# Altium schematic sheet Sheet1.SchDoc
size A4
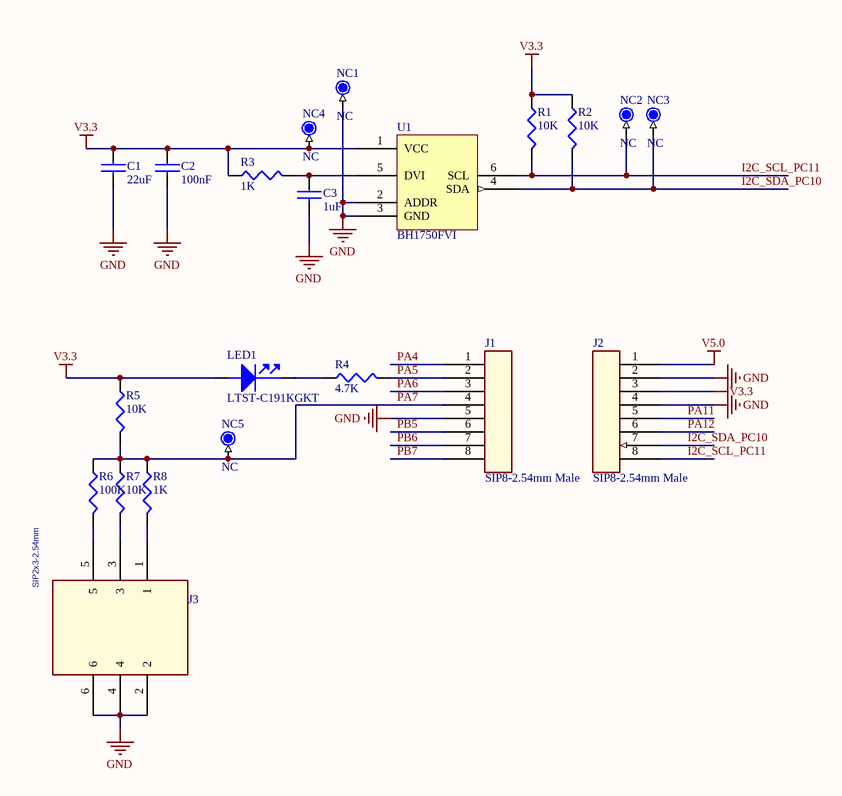
[diagram p0: Sheet1.SchDoc]

## Parts
C1  22uF  [SC0805]
C2  100nF  [SC0603]
C3  1uF  [SC0603]
J1  SIP8-2.54mm Male  [SIP-8P-100]
J2  SIP8-2.54mm Male  [SIP-8P-100]
J3  SIP2x3-2.54mm  [SIP-2X3P-100]
LED1  LTST-C191KGKT  [HSD0603-LED]
NC1  NC  [TP32-SMD]
NC2  NC  [TP32-SMD]
NC3  NC  [TP32-SMD]
NC4  NC  [TP32-SMD]
NC5  NC  [TP32-SMD]
R1  10K  [SR0603]
R2  10K  [SR0603]
R3  1K  [SR0603]
R4  4.7K  [SR0603]
R5  10K  [SR0603]
R6  100K  [SR0603]
R7  10K  [SR0603]
R8  1K  [SR0603]
U1  BH1750FVI  [sop6-20-105]

## Nets
GND: C1.2 C2.2 C3.2 J1.5 J2.2 J2.4 J3.2 J3.4 J3.6 NC1.1 U1.2(ADDR) U1.3(GND)
V3.3: C1.1 C2.1 J2.3 LED1.1 NC4.1 R1.1 R2.1 R3.1 R5.1 U1.1(VCC)
V5.0: J2.1
I2C_SCL_PC11: J2.8 NC2.1 R1.2 U1.6(SCL)
I2C_SDA_PC10: J2.7 NC3.1 R2.2 U1.4(SDA)
PA4: J1.1
PA5: J1.2 R4.2
PA6: J1.3
PA7: J1.4 NC5.1 R5.2 R6.1 R7.1 R8.1
PA11: J2.5
PA12: J2.6
PB5: J1.6
PB6: J1.7
PB7: J1.8
NetC3_1: C3.1 R3.2 U1.5(DVI)
NetJ3_1: J3.1 R8.2
NetJ3_3: J3.3 R7.2
NetJ3_5: J3.5 R6.2
NetLED1_2: LED1.2 R4.1

## Library data of the parts
C1-C3 = CAP NP
J1 J2 = HEADER8
J3 = CON2X3
LED1 = LED
NC1-NC5 = TP
R1-R8 = RESISTOR
U1 = BH1750FVI: 16 位数字输出型环境光强度传感器 ， I2C  BUS/-40 ℃ ～ +85 ℃